# Altium schematic sheet core.SchDoc
size A4
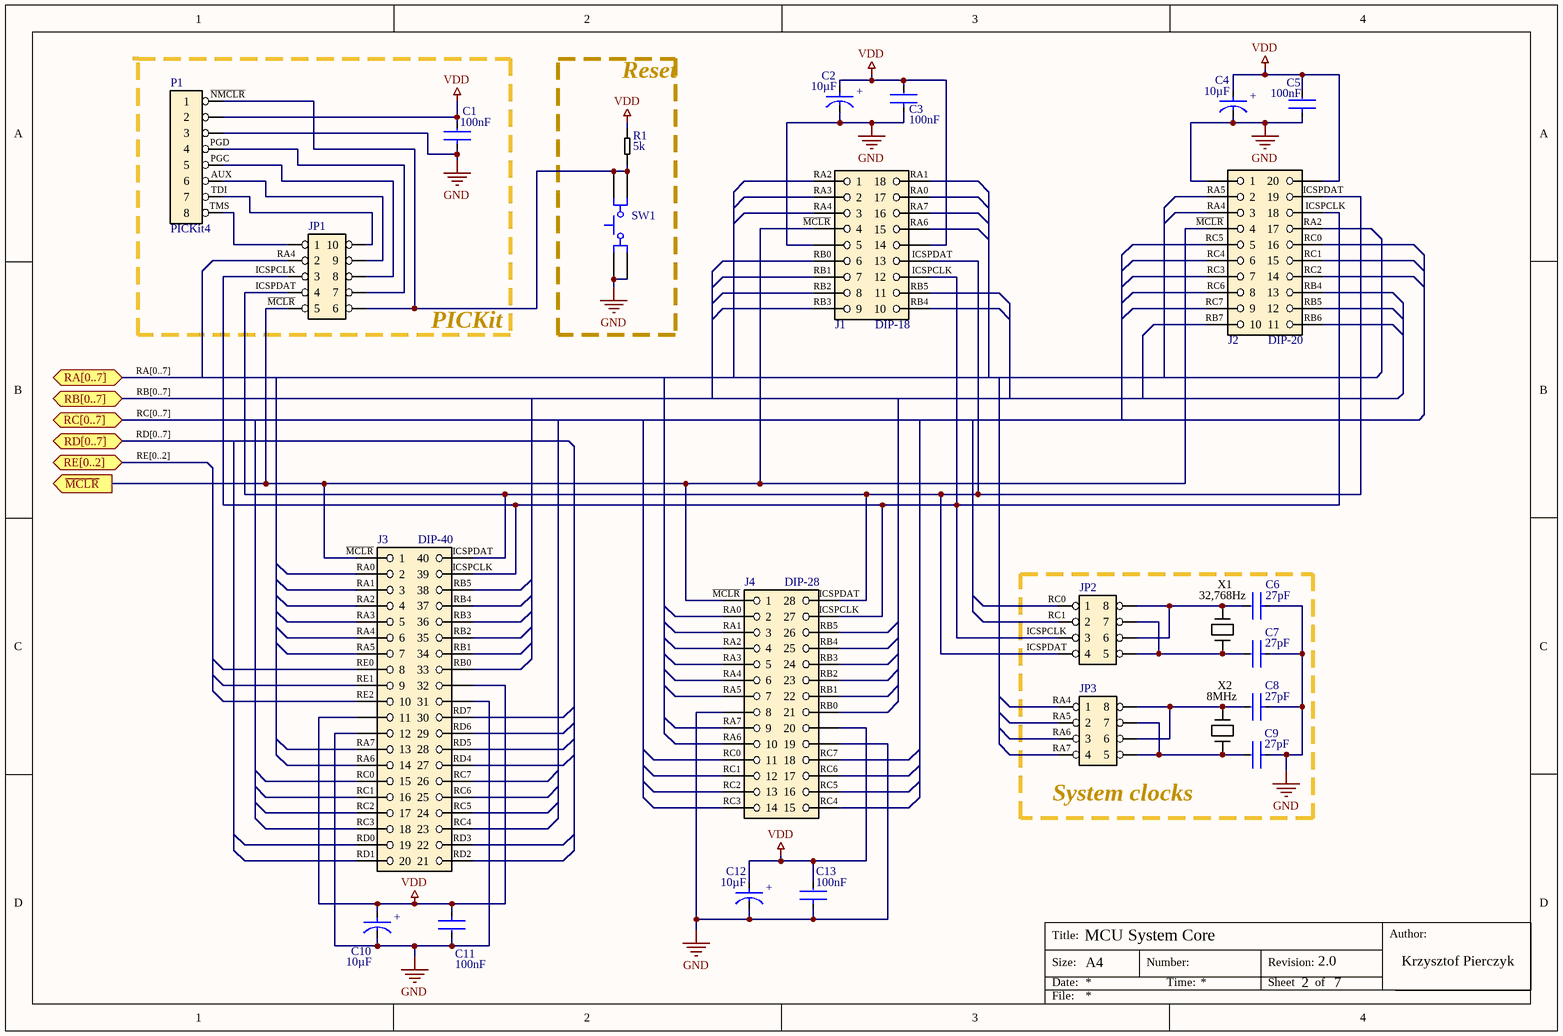
[diagram p0: core.SchDoc]

## Parts
C1  value 100nF  [FP-C0805C-DN-MFG]  (hidden comment: C0805C102J5GACTU)
C2  Capacitance: 10µF  [FP-F98S-MFG]  (hidden comment: F981C106MSAAS1)
C3  value 100nF  [FP-C0805C-DN-MFG]  (hidden comment: C0805C102J5GACTU)
C4  Capacitance: 10µF  [FP-F98S-MFG]  (hidden comment: F981C106MSAAS1)
C5  value 100nF  [FP-C0805C-DN-MFG]  (hidden comment: C0805C102J5GACTU)
C6  value 27pF  [FP-C0805C-DN-MFG]  (hidden comment: C0805C102J5GACTU)
C7  value 27pF  [FP-C0805C-DN-MFG]  (hidden comment: C0805C102J5GACTU)
C8  value 27pF  [FP-C0805C-DN-MFG]  (hidden comment: C0805C102J5GACTU)
C9  value 27pF  [FP-C0805C-DN-MFG]  (hidden comment: C0805C102J5GACTU)
C10  Capacitance: 10µF  [FP-F98S-MFG]  (hidden comment: F981C106MSAAS1)
C11  value 100nF  [FP-C0805C-DN-MFG]  (hidden comment: C0805C102J5GACTU)
C12  Capacitance: 10µF  [FP-F98S-MFG]  (hidden comment: F981C106MSAAS1)
C13  value 100nF  [FP-C0805C-DN-MFG]  (hidden comment: C0805C102J5GACTU)
J1  DIP-18  [DIP18]
J2  DIP-20  [DIP20]
J3  DIP-40  [DIP40]
J4  DIP-28  [DIP28]
JP1  Header 2x5  [Header2x5]  (value not drawn)
JP2  Header 2x4  [Header 2x4]  (value not drawn)
JP3  Header 2x4  [Header 2x4]  (value not drawn)
P1  PICKit4  [Header 1x8H]
R1  Resistance: 5k  [0805]  (hidden comment: Resistor)
SW1  4-1437565-1  [TECO-4-1437565-1_V]  (value not drawn)
X1  Frequency: 32,768Hz  [X32K768S315]  (hidden comment: Crystal)
X2  Frequency: 8MHz  [HC49SMP]  (hidden comment: Crystal)

## Blocks framed on the sheet
Reset: R1 SW1
System clocks: C6-C9 JP2 JP3 X1 X2

## Ports
RA[0..7] (bidir), RB[0..7] (bidir), RC[0..7] (bidir), RD[0..7] (bidir), RE[0..2] (bidir), ~{MCLR} (out)

## Nets
GND: C1.1 C2.1(C) C3.1 C4.1(C) C5.1 C6.1 C7.1 C8.1 C9.1 C10.1(C) C11.2 C12.1(C) C13.1 J1.5 J2.1 J3.12 J3.31 J4.8 J4.19 P1.3 SW1.1 SW1.2
VDD: C1.2 C2.2(A) C3.2 C4.2(A) C5.2 C10.2(A) C11.1 C12.2(A) C13.2 J1.14 J2.20 J3.11 J3.32 J4.20 P1.2 R1.1
AUX: JP1.9 P1.6
ICSPCLK: J1.12 J2.18 J3.39 J4.27 JP1.3 JP2.3
ICSPDAT: J1.13 J2.19 J3.40 J4.28 JP1.4 JP2.4
~{MCLR}: J1.4 J2.4 J3.1 J4.1 JP1.5 ; port ~{MCLR}
~{NMCLR}: JP1.6 P1.1 R1.2 SW1.3 SW1.4
PGC: JP1.8 P1.5
PGD: JP1.7 P1.4
RA0: J1.17 J3.2 J4.2
RA1: J1.18 J3.3 J4.3
RA2: J1.1 J2.17 J3.4 J4.4
RA3: J1.2 J3.5 J4.5
RA4: J1.3 J2.3 J3.6 J4.6 JP1.2 JP3.1
RA5: J2.2 J3.7 J4.7 JP3.2
RA6: J1.15 J3.14 J4.10 JP3.3
RA7: J1.16 J3.13 J4.9 JP3.4
RB0: J1.6 J3.33 J4.21
RB1: J1.7 J3.34 J4.22
RB2: J1.8 J3.35 J4.23
RB3: J1.9 J3.36 J4.24
RB4: J1.10 J2.13 J3.37 J4.25
RB5: J1.11 J2.12 J3.38 J4.26
RB6: J2.11
RB7: J2.10
RC0: J2.16 J3.15 J4.11 JP2.1
RC1: J2.15 J3.16 J4.12 JP2.2
RC2: J2.14 J3.17 J4.13
RC3: J2.7 J3.18 J4.14
RC4: J2.6 J3.23 J4.15
RC5: J2.5 J3.24 J4.16
RC6: J2.8 J3.25 J4.17
RC7: J2.9 J3.26 J4.18
RD0: J3.19
RD1: J3.20
RD2: J3.21
RD3: J3.22
RD4: J3.27
RD5: J3.28
RD6: J3.29
RD7: J3.30
RE0: J3.8
RE1: J3.9
RE2: J3.10
TDI: JP1.10 P1.7
TMS: JP1.1 P1.8
NetC6_2: C6.2 JP2.6 JP2.8 X1.1
NetC7_2: C7.2 JP2.5 JP2.7 X1.2
NetC8_2: C8.2 JP3.6 JP3.8 X2.1
NetC9_2: C9.2 JP3.5 JP3.7 X2.2

## Buses and harness runs
bus RA[0..7] = port RA[0..7]
bus RB[0..7] = port RB[0..7]
bus RC[0..7] = port RC[0..7]
bus RD[0..7] = port RD[0..7]
bus RE[0..2] = port RE[0..2]

## Notes on the sheet
- PICKit
- MCU System Core
- 2
- 2.0
- 7
- Title:
- Size:
- Date:
- A4
- Number:
- Time:
- Revision:
- Sheet
- of
- Author:
- Krzysztof Pierczyk
- File:
- (in symbol CMP-04424-000018-1) +

## Library data of the parts
C1 C3 C5-C9 C11 C13 = CMP-03020-008364-1: CAP CER 1000PF 50V C0G/NP0 0805; Manufacturer: KEMET; Capacitance: 1,000 pF; Temperature Characteristic: C0G; Material: Ceramic; Temperature Coefficient: 30ppm/°C; Tolerance: 0.05; Automotive: No; Voltage Rating: 50 V; Device Class L1: Passive Components; Digikey Description: CAP CER 1000PF 50V C0G/NP0 0805; Lead Free: Yes; Package: C0805C-DN; RoHS: TRUE; Temperature Range High: +125°C; Height: 0.88mm; Ipc Land Pattern Name: CAPC200125X78; Category: Cap; ComponentLink2URL: https://content.kemet.com/datasheets/KEM_C1003_C0G_SMD.pdf; Device Class L2: Capacitors; ComponentLink2Description: Datasheet; Temperature: -55°C to +125°C; Octopart: https://octopart.com/c0805c102j5gactu-kemet-97757; Mouser Description: Multilayer Ceramic Capacitors MLCC - SMD/SMT 50volts 1000pF C0G 5%; Manufacturer Part Number: C0805C102J5GACTU; Device Class L3: Ceramic Capacitors; Temperature Range Low: -55°C
C2 C4 C10 C12 = CMP-04424-000018-1: CAP TANT 10UF 20% 16V 0805; Manufacturer: AVX; Esr: 4.5Ω; Material: Tantalum; Ripple Current: 100mA; Leakage Current: 1.6uA; Life: 1000Hours; Dissipation Factor: 18%; Temperature Range High: +125°C; Temperature: -55°C to +125°C; Digikey Description: CAP TANT 10UF 20% 16V 0805; Tolerance: 20%; Automotive: No; Voltage Rating: 16V; Device Class L3: Tantalum Capacitors; Package: F98S; Device Class L2: Capacitors; Footprint Url: https://www.avx.com/download/software/literature/AVX-Footprint-Library.pdf; Mouser Description: Cap Tant Solid 10uF 16V S CASE 20% (2 x 1.25 x 0.8mm) SMD 2012-09 4.5Ohm 125°C T/R; Value: 10uF; ComponentLink2URL: http://datasheets.avx.com/F98-AS1.pdf; Height: 0.9mm; Manufacturer Part Number: F981C106MSAAS1; ComponentLink2Description: Datasheet; Lead Free: Yes; Category: Cap; Temperature Coefficient: 20%; RoHS: TRUE; Temperature Range Low: -55°C; Octopart: https://octopart.com/f981c106msaas1-avx-49645945; Device Class L1: Passive Components
J1 = DIP-18: Current rating: 1A; Voltage rating: 100V; Contact resistance (max): 15mohm; ComponentLink1Description: Datasheet; ComponentLink1URL: http://www.farnell.com/datasheets/2945665.pdf?_ga=2.253269833.1193962280.1589558354-303286379.1586364067&_gac=1.195417566.1589563198.Cj0KCQjw-_j1BRDkARIsAJcfmTFIG7O-lBwUzM7jXL1d54rcmK8ZCJrBZphKUIU-ia_1DnqilNgsh1YaAq1qEALw_wcB
J2 = DIP-20: Current rating: 1A; Voltage rating: 100V; Contact resistance (max): 15mohm; ComponentLink1Description: Datasheet; ComponentLink1URL: http://www.farnell.com/datasheets/2945665.pdf?_ga=2.253269833.1193962280.1589558354-303286379.1586364067&_gac=1.195417566.1589563198.Cj0KCQjw-_j1BRDkARIsAJcfmTFIG7O-lBwUzM7jXL1d54rcmK8ZCJrBZphKUIU-ia_1DnqilNgsh1YaAq1qEALw_wcB
J3 = DIP-40: Current rating: 1A; Voltage rating: 100V; Contact resistance (max): 15mohm; ComponentLink1Description: Datasheet; ComponentLink1URL: http://www.farnell.com/datasheets/2945665.pdf?_ga=2.253269833.1193962280.1589558354-303286379.1586364067&_gac=1.195417566.1589563198.Cj0KCQjw-_j1BRDkARIsAJcfmTFIG7O-lBwUzM7jXL1d54rcmK8ZCJrBZphKUIU-ia_1DnqilNgsh1YaAq1qEALw_wcB
J4 = DIP-28: Current rating: 1A; Voltage rating: 100V; Contact resistance (max): 15mohm; ComponentLink1Description: Datasheet; ComponentLink1URL: http://www.farnell.com/datasheets/2945665.pdf?_ga=2.253269833.1193962280.1589558354-303286379.1586364067&_gac=1.195417566.1589563198.Cj0KCQjw-_j1BRDkARIsAJcfmTFIG7O-lBwUzM7jXL1d54rcmK8ZCJrBZphKUIU-ia_1DnqilNgsh1YaAq1qEALw_wcB
P1 = Header 1x8 A
R1 = Resistor: Nominal power: 125mW
SW1 = CMP-2000-05602-1: Tactile Switch, 50 mA, 12 VDC, -20 to 85 degC, 4-Pin SMD, RoHS, Bulk; Manufacturer: TEConnectivity/AMPBrand; Illumination Type: N/R; Maximum Contact Resistance: 100mOhm; Actuator Style: RoundButton; Actuator Length: 1.4mm; Contact Rating @ Voltage: 0.05@12VDCA; Maximum DC Voltage Rating: 12V; Body Orientation: Straight; Ground Terminal: No; Dielectric Strength: 500VAC; Operating Force: 1.57N; Electrical Life: 100000Cycle; Mechanical Life: N/A; Family: FSMJSMA; Contact Material: CopperAlloy; Type: N/A; RoHS: Yes; Pole Throw Configuration: N/A; Operating Temperature: -20to85C; Minimum Insulation Resistance: 100MOhm; Package Description: 4-Pin Surface Mount Device, Body 6 x 6 mm, Pitch 9.1 mm; Housing Material: N/A; Switch Configuration: N/A; Mounting: SurfaceMount,GullWing; Datasheet URL: https://datasheet.ciiva.com/14635/0900766b80912216-14635826.pdf; Packaging: Bulk; Base Material: N/A; Actuator Color: N/A; Dimension: 6x10x5.25mm; Contact Plating: Silver; Seal Location: N/A; Mounting Technology: SurfaceMount; Part No: 4-1437565-1; Seal Description: N/A; Maximum AC Voltage Rating: N/A; Datasheet Version: 04/2007; Manufacturer URL: http://www.te.com/; Package Reference: 4-1437565-1; Product Weight: N/A
X1 X2 = Crystal: ComponentLink1Description: Datasheet; ComponentLink1URL: https://www.4timing.com/specification/hc49smp.pdf